# Altium schematic sheet ESPEV1.1.SchDoc
size A2
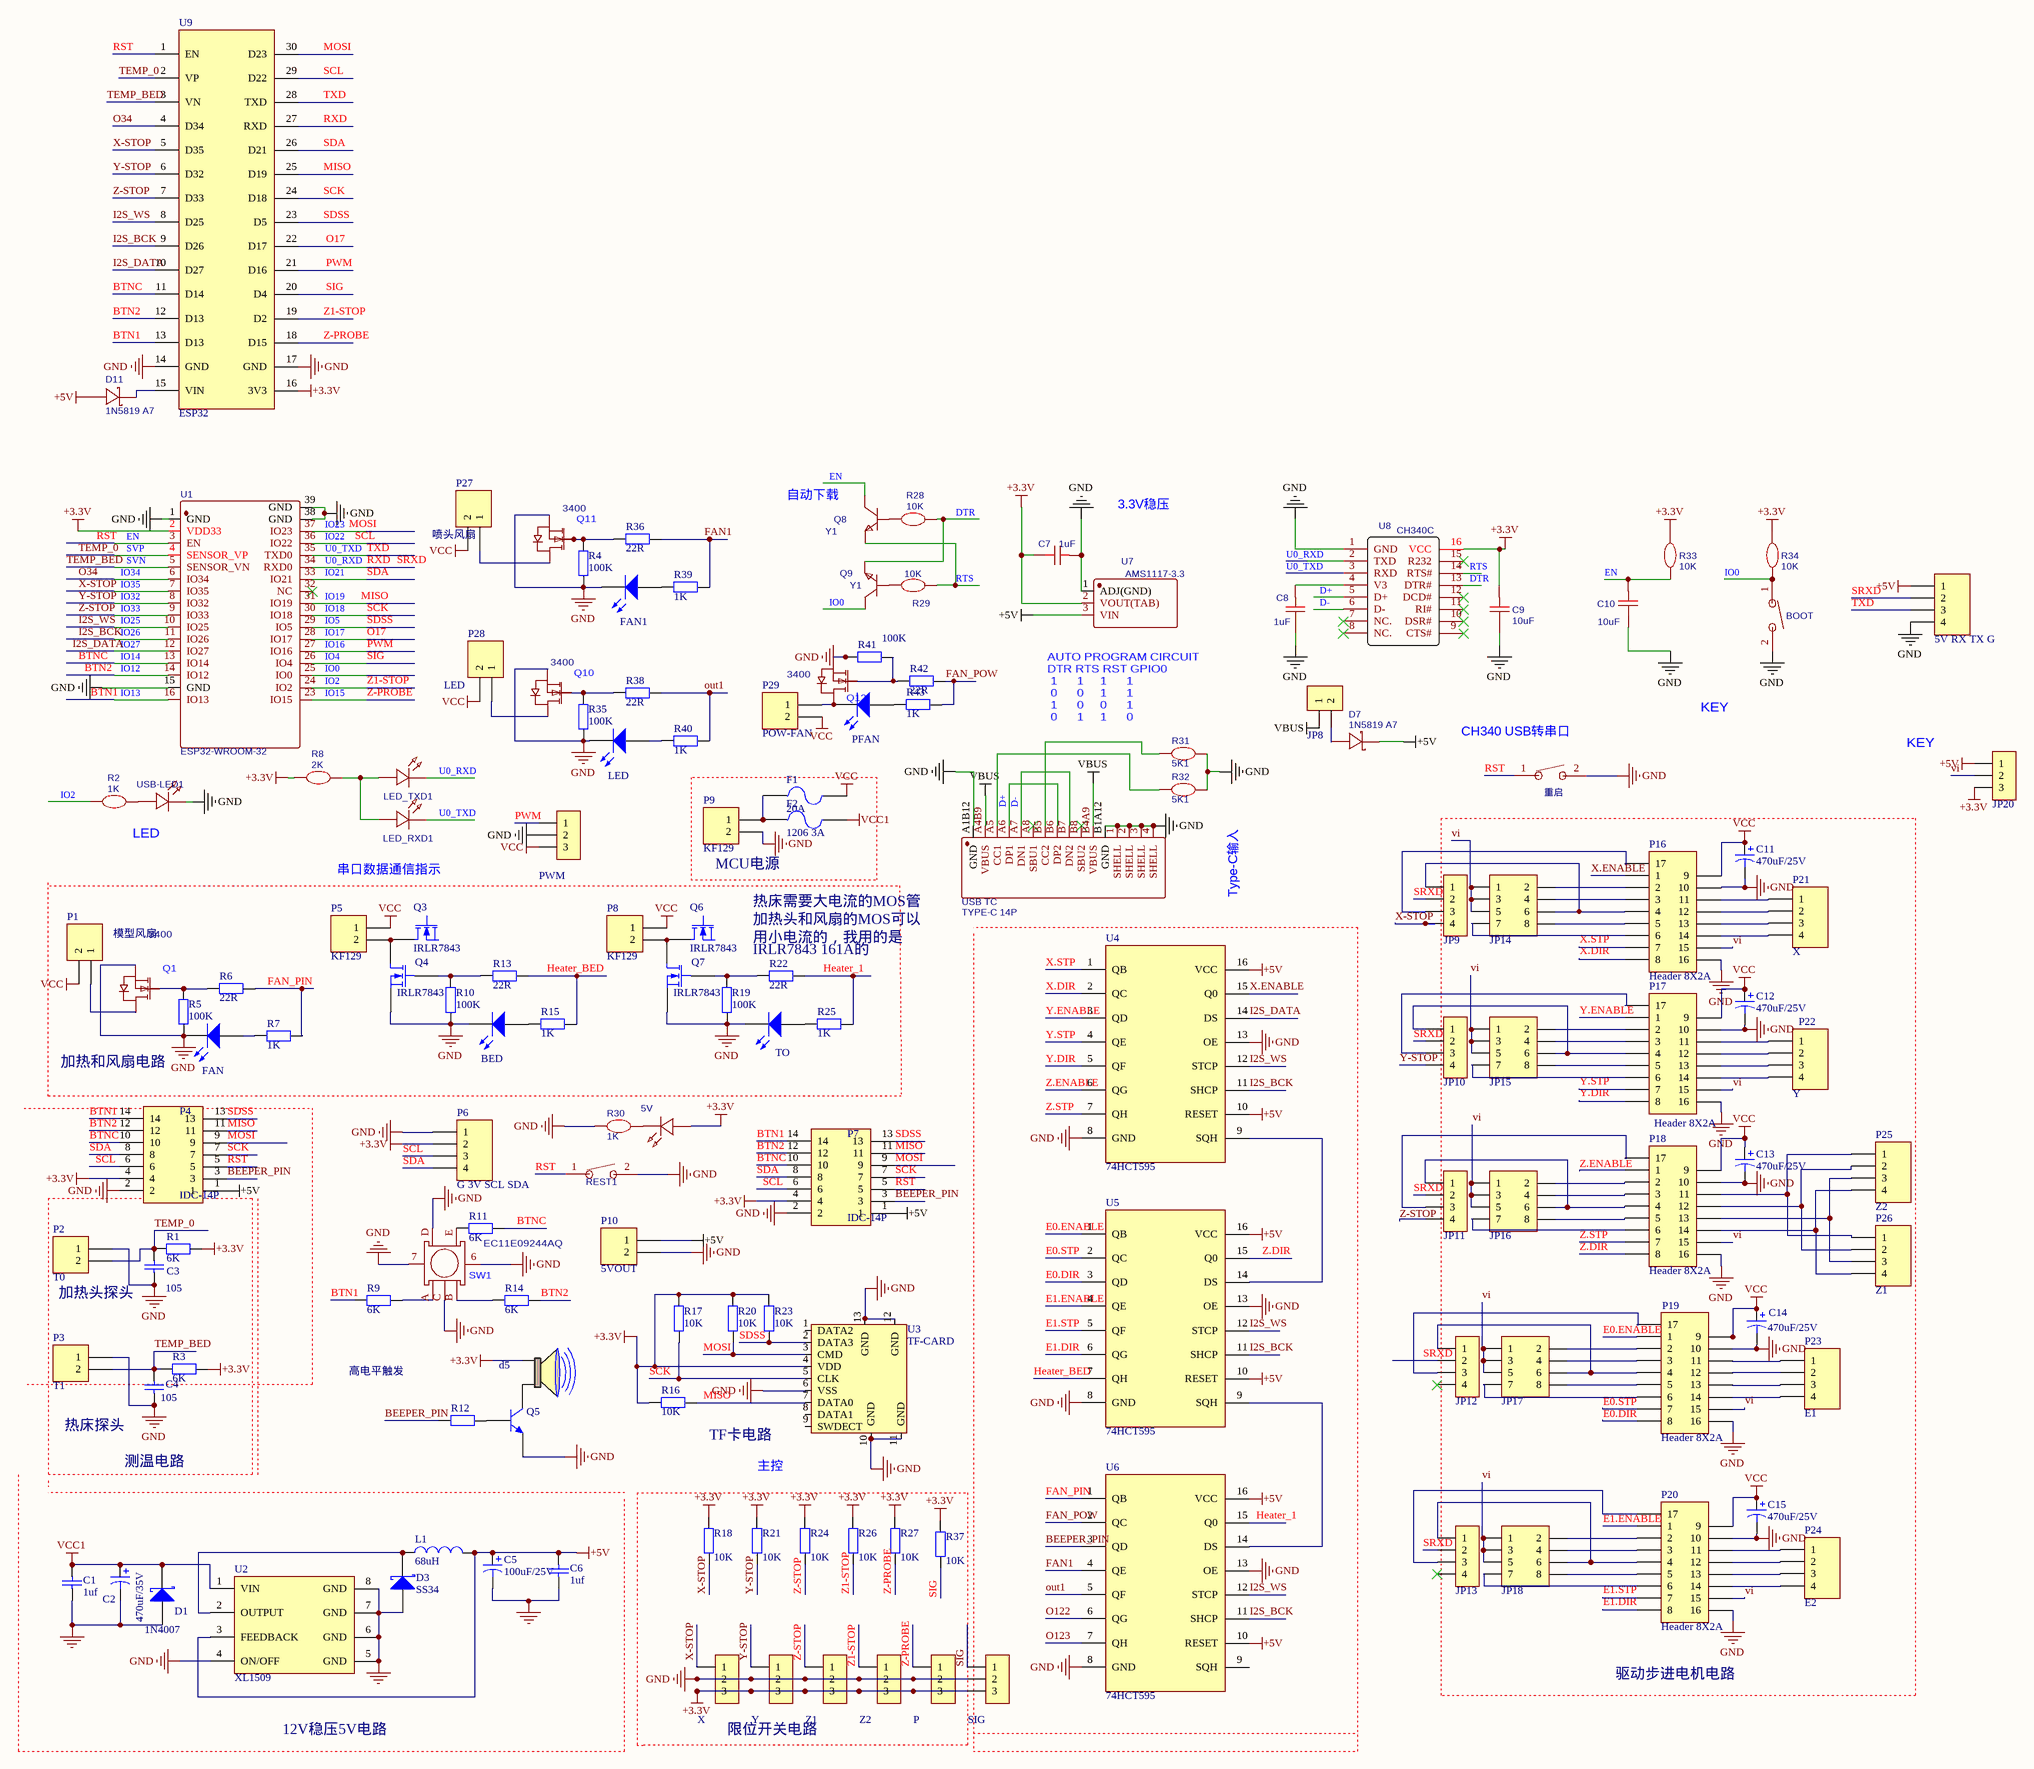
[diagram p0: ESPEV1.1.SchDoc]

## Parts
BOOT  BOOT  [SW-SMD_L4.0-W2.9-P4.15-EH]  (value not drawn)
C1  1uf  [C0603]
C2  470uF/35V  [SMD-EC10X10X10]
C3  value 105  [C0603]  (hidden comment: 1uf)
C4  value 105  [C0603]  (hidden comment: 1uf)
C5  100uF/25V  [SMD-EC6.3X6.3X10]
C6  1uf  [C0603]
C7  1uF  [C0603]
C8  1uF  [C0603]
C9  10uF  [C0603]
C10  10uF  [C0603]
C11  value 470uF/25V  [SMD-EC6.3X6.3X10]  (hidden comment: 100UF)
C12  value 470uF/25V  [SMD-EC6.3X6.3X10]  (hidden comment: 100UF)
C13  value 470uF/25V  [SMD-EC6.3X6.3X10]  (hidden comment: 100UF)
C14  value 470uF/25V  [SMD-EC6.3X6.3X10]  (hidden comment: 100UF)
C15  value 470uF/25V  [SMD-EC6.3X6.3X10]  (hidden comment: 100UF)
D1  1N4007  [SMA]
D2  FAN  [LED 0603B]
D3  SS34  [SMA]
D4  BED  [LED 0603B]
d5  buzzer  [BEEP 5x9x5.5]  (value not drawn)
D6  TO  [LED 0603B]
D7  1N5819 A7  [SOD-123_L2.8-W1.8-LS3.7-FD]
D8  FAN1  [LED 0603B]
D9  LED  [LED 0603B]
D10  PFAN  [LED 0603B]
D11  1N5819 A7  [SOD-123_L2.8-W1.8-LS3.7-FD]
F1  20A  [MCCQ-122]
F2  1206 3A  [FU 1206]
JP1  X  [XH2.54-LI-3P]
JP2  Y  [XH2.54-LI-3P]
JP3  SIG  [XH2.54-LI-3P]
JP4  Z1  [XH2.54-LI-3P]
JP5  Z2  [XH2.54-LI-3P]
JP6  P  [XH2.54-LI-3P]
JP7  PWM  [XH2.54-LI-3P]
JP8  U5V-ON  [HDR2.54-LI-2P]  (value not drawn)
JP9  URAT-无限位  [4P DL]  (value not drawn)
JP10  URAT-无限位  [4P DL]  (value not drawn)
JP11  URAT-无限位  [4P DL]  (value not drawn)
JP12  URAT-无限位  [4P DL]  (value not drawn)
JP13  URAT-无限位  [4P DL]  (value not drawn)
JP14  Header 4X2  [8P DL]  (value not drawn)
JP15  Header 4X2  [8P DL]  (value not drawn)
JP16  Header 4X2  [8P DL]  (value not drawn)
JP17  Header 4X2  [8P DL]  (value not drawn)
JP18  Header 4X2  [8P DL]  (value not drawn)
JP19  5V RX TX G  [HDR1X4]
JP20  3V-5V  [3P DL]  (value not drawn)
L1  68uH  [CDRH74]
LED1  5V  [LED 0603R]
LED_RXD1  RXD  [LED 0603G]  (value not drawn)
LED_TXD1  TXD  [LED 0603B]  (value not drawn)
P1  模型风扇  [XH2.54-LI-2P]
P2  T0  [XH2.54-LI-2P]
P3  T1  [XH2.54-LI-2P]
P4  IDC-14P  [IDC2.54-14P]
P5  KF129  [KF128-5.08-2P]
P6  G 3V SCL SDA  [OLED-0.96-PIN4]
P7  IDC-14P  [IDC2.54-14P]
P8  KF129  [KF128-5.08-2P]
P9  KF129  [KF128-5.08-2P]
P10  5VOUT  [XH2.54-LI-2P]
P16  Header 8X2A  [A4988]
P17  Header 8X2A  [A4988]
P18  Header 8X2A  [A4988]
P19  Header 8X2A  [A4988]
P20  Header 8X2A  [A4988]
P21  X  [XH2.54-LI-4P]
P22  Y  [XH2.54-LI-4P]
P23  E1  [XH2.54-LI-4P]
P24  E2  [XH2.54-LI-4P]
P25  Z2  [XH2.54-LI-4P]
P26  Z1  [XH2.54-LI-4P]
P27  喷头风扇  [XH2.54-LI-2P]
P28  LED  [XH2.54-LI-2P]
P29  POW-FAN  [XH2.54-LI-2P]
Q1  3400  [SOT-23-3]
Q3  IRLR7843  [TO-252gk]
Q4  IRLR7843  [TO-252]
Q5  Y1  [SOT-23-3]  (value not drawn)
Q6  IRLR7843  [TO-252gk]
Q7  IRLR7843  [TO-252]
Q8  Y1  [SOT-23-3]
Q9  Y1  [SOT-23-3]
Q10  3400  [SOT-23-3]
Q11  3400  [SOT-23-3]
Q12  3400  [SOT-23-3]
R1  6K  [R0603]
R2  1K  [R0603]
R3  6K  [R0603]
R4  100K  [R0603]
R5  100K  [R0603]
R6  22R  [R0603]
R7  1K  [R0603]
R8  2K  [R0603]
R9  6K  [R0603]
R10  100K  [R0603]
R11  6K  [R0603]
R12  4.7K  [R0603]  (value not drawn)
R13  22R  [R0603]
R14  6K  [R0603]
R15  1K  [R0603]
R16  10K  [R0603]
R17  10K  [R0603]
R18  10K  [R0603]
R19  100K  [R0603]
R20  10K  [R0603]
R21  10K  [R0603]
R22  22R  [R0603]
R23  10K  [R0603]
R24  10K  [R0603]
R25  1K  [R0603]
R26  10K  [R0603]
R27  10K  [R0603]
R28  10K  [R0603]
R29  10K  [R0603]
R30  1K  [R0603]
R31  5K1  [R0603]
R32  5K1  [R0603]
R33  10K  [R0603]
R34  10K  [R0603]
R35  100K  [R0603]
R36  22R  [R0603]
R37  10K  [R0603]
R38  22R  [R0603]
R39  1K  [R0603]
R40  1K  [R0603]
R41  100K  [R0603]
R42  22R  [R0603]
R43  1K  [R0603]
REST1  REST  [SMD-6X6X6]  (value not drawn)
REST2  重启  [SW-SMD_L4.0-W2.9-P4.15-EH]
SW1  EC11E09244AQ  [SW-TH_EC11E15244G1]
U1  ESP32-WROOM-32  [WIFIM-SMD_39P-L25.5-W18.0-P1.27]
U2  XL1509  [SOP8 - duplicate]
U3  TF-CARD  [MicroSD]
U4  74HCT595  [SOP16_1.27mm]
U5  74HCT595  [SOP16_1.27mm]
U6  74HCT595  [SOP16_1.27mm]
U7  AMS1117-3.3  [SOT-223-4_L6.5-W3.5-P2.30-LS7.0-BR]
U8  CH340C  [SOP-16_L10.0-W3.9-P1.27-LS6.0-BL]
U9  ESP32  [ESP3215P]
USB-LED1  UPWD  [LED 0603R]  (value not drawn)
USB_TC  TYPE-C 14P  [USB-C-SMD_TYPE-C16PIN]

## Blocks framed on the sheet
MCU电源: F1 F2 P9
驱动步进电机电路: C11-C15 JP9-JP18 P16-P26
限位开关电路: JP1 JP2 JP4-JP6 R18 R21 R24 R26 R27 R37

## Nets
+3.3V: C7.1 C9.2 d5.1 JP1.3 JP2.3 JP3.3 JP4.3 JP5.3 JP6.3 JP20.3 LED1.1 P4.4 P6.2 P7.4 R1.1 R3.2 R8.1 R16.1 R17.1 R18.2 R20.1 R21.2 R23.1 R24.2 R26.2 R27.2 R33.2 R34.2 R37.2 U1.2(VDD33) U3.4(VDD) U7.2(VOUT(TAB)) U8.16(VCC) U9.16(3V3)
+5V: C5.1 C6.2 D7.2(K) D11.1(A) JP19.1 JP20.1 L1.2 P4.1 P7.1 P10.1 U2.3(FEEDBACK) U4.10(RESET) U4.16(VCC) U5.10(RESET) U5.16(VCC) U6.10(RESET) U6.16(VCC) U7.3(VIN)
GND: BOOT.2 C1.2 C2.2 C3.2 C4.2 C5.2 C6.1 C7.2 C8.1 C9.1 C10.1 C11.2 C12.2 C13.2 C14.2 C15.2 D1.1(A) D2.2(K) D3.1(A) D4.2(K) D6.2(K) D8.2(K) D9.2(K) JP1.2 JP2.2 JP3.2 JP4.2 JP5.2 JP6.2 JP7.2 JP19.4 P2.1 P3.1 P4.2 P6.1 P7.2 P9.2 P10.2 P16.10 P16.16 P17.10 P17.16 P18.10 P18.16 P19.10 P19.16 P20.10 P20.16 Q1.2(S) Q4.3(S) Q5.2(E) Q7.3(S) Q10.2(S) Q11.2(S) Q12.2(S) R4.1 R5.1 R10.1 R19.1 R30.2 R31.1 R32.1 R35.1 R41.2 REST1.2 REST2.2 SW1.6 SW1.7 SW1.C SW1.D U1.1(GND) U1.15(GND) U1.38(GND) U1.39(GND) U2.4(ON/OFF) U2.5(GND) U2.6(GND) U2.7(GND) U2.8(GND) U3.6(VSS) U3.10(GND) U3.11(GND) U3.12(GND) U3.13(GND) U4.8(GND) U4.13(OE) U5.8(GND) U5.13(OE) U6.8(GND) U6.13(OE) U7.1(ADJ(GND)) U8.1(GND) U9.14(GND) U9.17(GND) USB-LED1.2 USB_TC.1(SHELL) USB_TC.2(SHELL) USB_TC.3(SHELL) USB_TC.4(SHELL) USB_TC.A1B12(GND) USB_TC.B1A12(GND)
VBUS: JP8.1 USB_TC.A4B9(VBUS) USB_TC.B4A9(VBUS)
VCC: C11.1 C12.1 C13.1 C14.1 C15.1 F1.2 JP7.3 P1.2 P5.1 P8.1 P16.9 P17.9 P18.9 P19.9 P20.9 P27.2 P28.2 P29.2
VCC1: C1.1 C2.1 D1.2(K) F2.2 U2.1(VIN)
BEEPER_PIN: P4.3 P7.3 R12.1 U6.3(QD)
BTN1: P4.14 P7.14 R9.1 U1.16(IO13) U9.13(D13)  [also labelled IO13]
BTN2: P4.12 P7.12 R14.2 U1.14(IO12) U9.12(D13)  [also labelled IO12]
BTNC: P4.10 P7.10 R11.1 U1.13(IO14) U9.11(D14)  [also labelled IO14]
D+: U8.5(D+) USB_TC.A6(DP1) USB_TC.B6(DP2)
D-: U8.6(D-) USB_TC.A7(DN1) USB_TC.B7(DN2)
DTR: Q9.2(E) R28.2 U8.13(DTR#)
E0.DIR: P19.8 U5.3(QD)
E0.ENABLE: P19.1 U5.1(QB)
E0.STP: P19.7 U5.2(QC)
E1.DIR: P20.8 U5.6(QG)
E1.ENABLE: P20.1 U5.4(QE)
E1.STP: P20.7 U5.5(QF)
EN: C10.2 P4.5 P7.5 Q8.3(C) R33.1 REST1.1 REST2.1 U1.3(EN) U9.1(EN)  [also labelled RST]
FAN1: R36.1 R39.1 U6.4(QE)
FAN_PIN: R6.1 R7.1 U6.1(QB)
FAN_POW: R42.1 R43.1 U6.2(QC)
Heater_1: R22.1 R25.1 U6.15(Q0)
Heater_BED: R13.1 R15.1 U5.7(QH)
I2S_BCK: U1.11(IO26) U4.11(SHCP) U5.11(SHCP) U6.11(SHCP) U9.9(D26)  [also labelled IO26]
I2S_DATA: U1.12(IO27) U4.14(DS) U9.10(D27)  [also labelled IO27]
I2S_WS: U1.10(IO25) U4.12(STCP) U5.12(STCP) U6.12(STCP) U9.8(D25)  [also labelled IO25]
IO0: BOOT.1 Q9.3(C) R34.1 U1.25(IO0)
IO2: JP5.1 R2.1 R26.1 U1.24(IO2) U9.19(D2)  [also labelled Z1-STOP]
IO4: JP3.1 R37.1 U1.26(IO4) U9.20(D4)  [also labelled SIG]
IO5: P4.13 P7.13 R23.2 U1.29(IO5) U3.2(DATA3) U9.23(D5)  [also labelled SDSS]
IO15: JP6.1 R27.1 U1.23(IO15) U9.18(D15)  [also labelled Z-PROBE]
IO16: JP7.1 U1.27(IO16) U9.21(D16)  [also labelled PWM]
IO17: U1.28(IO17) U9.22(D17)  [also labelled O17]
IO18: P4.7 P7.7 R17.2 U1.30(IO18) U3.5(CLK) U9.24(D18)  [also labelled SCK]
IO19: P4.11 P7.11 R16.2 U1.31(IO19) U3.7(DATA0) U9.25(D19)  [also labelled MISO]
IO21: P4.8 P6.4 P7.8 U1.33(IO21) U9.26(D21)  [also labelled SDA]
IO22: P4.6 P6.3 P7.6 U1.36(IO22) U9.29(D22)  [also labelled SCL]
IO23: P4.9 P7.9 R20.2 U1.37(IO23) U3.3(CMD) U9.30(D23)  [also labelled MOSI]
IO32: JP2.1 JP10.4 R21.1 U1.8(IO32) U9.6(D32)  [also labelled Y-STOP]
IO33: JP4.1 JP11.4 R24.1 U1.9(IO33) U9.7(D33)  [also labelled Z-STOP]
IO34: U1.6(IO34) U9.4(D34)  [also labelled O34]
IO35: JP1.1 JP9.4 R18.1 U1.7(IO35) U9.5(D35)  [also labelled X-STOP]
O122: U6.6(QG)
O123: U6.7(QH)
out1: R38.1 R40.1 U6.5(QF)
RTS: Q8.2(E) R29.2 U8.14(RTS#)
RXD: JP9.2 JP10.2 JP11.2 JP12.2 JP13.2 JP19.2 LED_TXD1.2 U1.34(RXD0) U8.2(TXD) U9.27(RXD)  [also labelled SRXD, U0_RXD]
SVN: C4.1 P3.2 R3.1 U1.5(SENSOR_VN) U9.3(VN)  [also labelled TEMP_BED]
SVP: C3.1 P2.2 R1.2 U1.4(SENSOR_VP) U9.2(VP)  [also labelled TEMP_0]
TXD: JP19.3 LED_RXD1.2 U1.35(TXD0) U8.3(RXD) U9.28(TXD)  [also labelled U0_TXD]
vi: JP14.1 JP14.3 JP14.5 JP15.1 JP15.3 JP15.5 JP16.1 JP16.3 JP16.5 JP17.1 JP17.3 JP17.5 JP18.1 JP18.3 JP18.5 JP20.2 P16.15 P17.15 P18.15 P19.15 P20.15
X.DIR: P16.8 U4.2(QC)
X.ENABLE: P16.1 U4.15(Q0)
X.STP: P16.7 U4.1(QB)
Y.DIR: P17.8 U4.5(QF)
Y.ENABLE: P17.1 U4.3(QD)
Y.STP: P17.7 U4.4(QE)
Z.DIR: P18.8 U5.15(Q0)
Z.ENABLE: P18.1 U4.6(QG)
Z.STP: P18.7 U4.7(QH)
NetC8_2: C8.2 U8.4(V3)
NetD2_1: D2.1(A) R7.2
NetD3_2: D3.2(K) L1.1 U2.2(OUTPUT)
NetD4_1: D4.1(A) R15.2
Netd5_2: d5.2 Q5.3(C)
NetD6_1: D6.1(A) R25.2
NetD7_1: D7.1(A) JP8.2
NetD8_1: D8.1(A) R39.2
NetD9_1: D9.1(A) R40.2
NetD10_1: D10.1(A) R43.2
NetD10_2: D10.2(K) P29.1 Q12.3(D)
NetD11_2: D11.2(K) U9.15(VIN)
NetF1_1: F1.1 F2.1 P9.1
NetJP9_1: JP9.1 JP14.6 P16.4
NetJP9_3: JP9.3 P16.17
NetJP10_1: JP10.1 JP15.6 P17.4
NetJP10_3: JP10.3 P17.17
NetJP11_1: JP11.1 JP16.6 P18.4
NetJP11_3: JP11.3 P18.17
NetJP12_1: JP12.1 JP17.6 P19.4
NetJP12_3: JP12.3 P19.17
NetJP13_1: JP13.1 JP18.6 P20.4
NetJP13_3: JP13.3 P20.17
NetJP14_2: JP14.2 P16.2
NetJP14_4: JP14.4 P16.3
NetJP14_7: JP14.7 P16.6
NetJP14_8: JP14.8 P16.5
NetJP15_2: JP15.2 P17.2
NetJP15_4: JP15.4 P17.3
NetJP15_7: JP15.7 P17.6
NetJP15_8: JP15.8 P17.5
NetJP16_2: JP16.2 P18.2
NetJP16_4: JP16.4 P18.3
NetJP16_7: JP16.7 P18.6
NetJP16_8: JP16.8 P18.5
NetJP17_2: JP17.2 P19.2
NetJP17_4: JP17.4 P19.3
NetJP17_7: JP17.7 P19.6
NetJP17_8: JP17.8 P19.5
NetJP18_2: JP18.2 P20.2
NetJP18_4: JP18.4 P20.3
NetJP18_7: JP18.7 P20.6
NetJP18_8: JP18.8 P20.5
NetLED1_2: LED1.2 R30.1
NetLED_RXD1_1: LED_RXD1.1 LED_TXD1.1 R8.2
NetP1_1: P1.1 Q1.3(D)
NetP5_2: P5.2 Q3.1(D) Q4.1(D)
NetP8_2: P8.2 Q6.1(D) Q7.1(D)
NetP16_11: P16.11 P21.1
NetP16_12: P16.12 P21.2
NetP16_13: P16.13 P21.3
NetP16_14: P16.14 P21.4
NetP17_11: P17.11 P22.1
NetP17_12: P17.12 P22.2
NetP17_13: P17.13 P22.3
NetP17_14: P17.14 P22.4
NetP18_11: P18.11 P25.1 P26.1
NetP18_12: P18.12 P25.2 P26.2
NetP18_13: P18.13 P25.3 P26.3
NetP18_14: P18.14 P25.4 P26.4
NetP19_11: P19.11 P23.1
NetP19_12: P19.12 P23.2
NetP19_13: P19.13 P23.3
NetP19_14: P19.14 P23.4
NetP20_11: P20.11 P24.1
NetP20_12: P20.12 P24.2
NetP20_13: P20.13 P24.3
NetP20_14: P20.14 P24.4
NetP27_1: P27.1 Q11.3(D)
NetP28_1: P28.1 Q10.3(D)
NetQ1_1: Q1.1(G) R5.2 R6.2
NetQ4_2: Q4.2(G) R10.2 R13.2
NetQ5_1: Q5.1(B) R12.2
NetQ7_2: Q7.2(G) R19.2 R22.2
NetQ8_1: Q8.1(B) R28.1
NetQ9_1: Q9.1(B) R29.1
NetQ10_1: Q10.1(G) R35.2 R38.2
NetQ11_1: Q11.1(G) R4.2 R36.2
NetQ12_1: Q12.1(G) R41.1 R42.2
NetR2_2: R2.2 USB-LED1.1
NetR9_2: R9.2 SW1.A
NetR11_2: R11.2 SW1.E
NetR14_1: R14.1 SW1.B
NetR31_2: R31.2 USB_TC.B5(CC2)
NetR32_2: R32.2 USB_TC.A5(CC1)
NetU4_9: U4.9(SQH) U5.14(DS)
NetU5_9: U5.9(SQH) U6.14(DS)

Not connected (* = marked no-connect by the designer): JP12 4*; JP13 4*; U1 32(NC)*; U3 1(DATA2) 8(DATA1) 9(SWDECT); U6 9(SQH); U8 7(NC.)* 8(NC.)* 9(CTS#)* 10(DSR#)* 11(RI#)* 12(DCD#)* 15(R232)*; USB_TC A8(SBU1)* B8(SBU2)*

## Notes on the sheet
- 自动下载
- 3.3V稳压
- AUTO PROGRAM CIRCUIT
  DTR RTS RST GPIO0
  1      1     1      1
  0      0     1      1
  1      0     0      1
  0      1     1      0
- KEY
- (near REST2) CH340 USB转串口
- LED
- 串口数据通信指示
- Type-C输入
- 热床需要大电流的MOS管
- 加热头和风扇的MOS可以
- (near R22) 用小电流的，我用的是
- (near R22) IRLR7843 161A的
- 加热和风扇电路
- (near P2) 加热头探头
- 高电平触发
- 热床探头
- (near R16) TF卡电路
- 测温电路
- 主控
- 12V稳压5V电路

## Library data of the parts
BOOT REST1 REST2 = TSA343G00D-250J2: BOM_Manufacturer: BRIGHT; Contributor: LCSC; BOM_Paste Type: expand; BOM_Assembly Type: smtWeld; BOM_Supplier: LCSC; BOM_Supplier Part: C354947; BOM_Manufacturer Part: TSA343G00D-250J2; spicePre: S; spiceSymbolName: TSA343G00D-250J2
C1 C6 = Cap: Capacitor; Value: 100pF; Published: 8-Jun-2000; LatestRevisionDate: 17-Jul-2002; LatestRevisionNote: Re-released for DXP Platform.; PackageReference: RAD-0.3; Publisher: Altium Limited; PackageDescription: Radial Cap, Thru-Hole; 2 Leads; 0.3 in Pin Spacing
C2 C5 = Cap Pol3: Polarized Capacitor (Surface Mount); Value: 100pF; Published: 8-Jun-2000; LatestRevisionDate: 29-May-2009; LatestRevisionNote: IPC-7351 Footprint Added.; PackageReference: C0805; Publisher: Altium Limited; PackageDescription: Chip Capacitor
C3 C4 = Cap: Capacitor; Published: 8-Jun-2000; LatestRevisionDate: 17-Jul-2002; LatestRevisionNote: Re-released for DXP Platform.; PackageReference: RAD-0.3; Publisher: Altium Limited
C7 C9 C10 = 10uF: nameAlias: Value(F); Contributor: LCEDA_Lib; spicePre: C; spiceSymbolName: C_0603_US
C8 = 1uF: BOM_Manufacturer Part: 0603F105M250NT; BOM_Manufacturer: FH; nameAlias: Value(F); Contributor: LCEDA_Lib; BOM_Supplier Part: C36577; BOM_Supplier: LCSC; spicePre: C; spiceSymbolName: C_0603_US
C11-C15 = Cap Pol1: Polarized Capacitor (Radial); Published: 8-Jun-2000; LatestRevisionDate: 17-Jul-2002; LatestRevisionNote: Re-released for DXP Platform.; PackageReference: RB7.6-15; Publisher: Altium Limited
D1 D3 = D Schottky: Schottky Diode; Published: 8-Jun-2000; LatestRevisionDate: 17-Jul-2002; LatestRevisionNote: Re-released for DXP Platform.; PackageReference: SMB; Publisher: Altium Limited; Code_JEDEC: DO-214-AA
D2 D4 D6 D8-D10 = LED2: Typical RED, GREEN, YELLOW, AMBER GaAs LED; Published: 8-Jun-2000; LatestRevisionDate: 17-Jul-2002; LatestRevisionNote: Re-released for DXP Platform.; PackageVersion: Feb-2002; PackageReference: 3.2X1.6X1.1; Publisher: Altium Limited
d5 = buzzer: bu
D7 D11 = 1N5819HW-7-F: BOM_Manufacturer: DIODES; BOM_Paste Type: expand; BOM_Assembly Type: smtWeld; BOM_Supplier: LCSC; BOM_Manufacturer Part: 1N5819HW-7-F; image: //image.lceda.cn/szlcsc/C82544.jpg; BOM_Supplier Part: C82544; spicePre: D; spiceSymbolName: 1N5819HW-7-F
F1 F2 = Fuse 2: Fuse; Published: 8-Jun-2000; LatestRevisionDate: 17-Jul-2002; LatestRevisionNote: Re-released for DXP Platform.; PackageReference: PIN-W2/E2.8; Publisher: Altium Limited; PackageDescription: Thru-Hole; 2 Leads
JP1-JP7 JP20 = Header 3: 3P接插件; 版权归属: 源创客; BOM名称: 3P接插件; 学习资源: www.ooocke.com
JP8 = Header 2: 2P接插件; 版权归属: 源创客; BOM名称: 2P接插件; 学习资源: www.ooocke.com
JP9-JP13 = Header 4: 4P接插件; 版权归属: 源创客; BOM名称: 4P接插件; 学习资源: www.ooocke.com
JP14-JP18 = Header 4X2: 4*2P接插件; 版权归属: 源创客; BOM名称: 4*2P接插件; 学习资源: www.ooocke.com
JP19 P6 P21-P26 = Header 4: Header, 4-Pin; LatestRevisionDate: 17-Jul-2002; LatestRevisionNote: Re-released for DXP Platform.; Publisher: Altium Limited
L1 = Inductor: Code_IEC: 1005; Value: 10mH; Published: 8-Jun-2000; LatestRevisionDate: 29-May-2009; LatestRevisionNote: IPC-7351 Footprint Added.; PackageReference: 0402-A; Publisher: Altium Limited; PackageDescription: Chip Inductor; Code_JEITA: 0402
LED1 = IO2: BOM_Manufacturer: EVERLIGHT(台湾亿光); BOM_Manufacturer Part: 19-217/R6C-AL1M2VY/3T; Contributor: LCEDA_01; BOM_Supplier Part: C72044; BOM_Supplier: LCSC; spicePre: L; spiceSymbolName: LED-0603_R
LED_RXD1 = RXD: BOM_Manufacturer: EVERLIGHT(台湾亿光); BOM_Manufacturer Part: 19-217/R6C-AL1M2VY/3T; Contributor: LCEDA_01; BOM_Supplier Part: C72044; BOM_Supplier: LCSC; spicePre: L; spiceSymbolName: LED-0603_R
LED_TXD1 = TXD: BOM_Manufacturer: EVERLIGHT(台湾亿光); BOM_Manufacturer Part: 19-217/R6C-AL1M2VY/3T; Contributor: LCEDA_01; BOM_Supplier Part: C72044; BOM_Supplier: LCSC; spicePre: L; spiceSymbolName: LED-0603_R
P1-P3 P5 P8-P10 P27-P29 = Header 2: Header, 2-Pin; LatestRevisionDate: 17-Jul-2002; LatestRevisionNote: Re-released for DXP Platform.; Publisher: Altium Limited
P16-P20 = Header 8X2A: Header, 8-Pin, Dual row; LatestRevisionDate: 17-Jul-2002; LatestRevisionNote: Re-released for DXP Platform.; Publisher: Altium Limited
Q1 Q10-Q12 = AO3400_C693097
Q3 Q6 = MOSFET-Ngk: N-Channel MOSFET; Published: 8-Jun-2000; LatestRevisionDate: 17-Jul-2002; LatestRevisionNote: Re-released for DXP Platform.; PackageVersion: 1995/1996; PackageReference: E3; Publisher: Altium Limited
Q4 Q7 = MOSFET-N: N-Channel MOSFET; Published: 8-Jun-2000; LatestRevisionDate: 17-Jul-2002; LatestRevisionNote: Re-released for DXP Platform.; PackageVersion: 1995/1996; PackageReference: E3; Publisher: Altium Limited
Q5 = SOT-23 SS8050 Y1: SS8050 Y1三极管; ComponentLink1Description: 供应商链接; ComponentLink1URL: http://www.szlcsc.com/product/details_2507.html; Package: SOT-23; Supplier: LC; SuppliersPartNumber: C2150
Q8 Q9 = S8050: BOM_Manufacturer: WPMtek(维攀微); Contributor: LCSC; BOM_Supplier: LCSC; BOM_Supplier Part: C2688231; BOM_Manufacturer Part: S8050; spicePre: Q; spiceSymbolName: S8050
R1 R3-R7 R9-R11 R13-R27 R35-R43 = Res2: Resistor; Published: 8-Jun-2000; LatestRevisionDate: 17-Jul-2002; LatestRevisionNote: Re-released for DXP Platform.; PackageReference: AXIAL-0.4; Publisher: Altium Limited
  R1 R3 R9 R11 R14: Value: 6K
  R4 R5 R10 R19 R35 R41: Value: 100K
  R6 R13 R22 R36 R38 R42: Value: 22R
  R7 R15 R25 R39 R40 R43: Value: 1K
  R16-R18 R20 R21 R23 R24 R26 R27 R37: Value: 10K
R2 R30 = 1K: nameAlias: Value(Ω); Contributor: LCEDA_Lib; spicePre: R; spiceSymbolName: R_0603_EU
R8 = 2K: nameAlias: Value(Ω); Contributor: LCEDA_Lib; spicePre: R; spiceSymbolName: R_0603_EU
R12 = 0805 4.7KΩ (4701) 1%: 4.7KΩ (4701) ±1%贴片电阻; ComponentLink1Description: 供应商链接; ComponentLink1URL: http://www.szlcsc.com/product/details_18361.html; Package: 0805; Supplier: LC; SuppliersPartNumber: C17673
R28 R29 R33 R34 = 10K: nameAlias: Value(Ω); Contributor: LCEDA_Lib; spicePre: R; spiceSymbolName: R_0603_EU
R31 R32 = 5K1: nameAlias: Value(Ω); Contributor: LCEDA_Lib; spicePre: R; spiceSymbolName: R_0603_EU
U1 = ESP32-WROOM-32: BOM_Manufacturer: Espressif Systems; Contributor: LCSC; BOM_Supplier: LCSC; BOM_Supplier Part: C503587; BOM_Manufacturer Part: ESP32-WROOM-32; spicePre: U; spiceSymbolName: ESP32-WROOM-32
U2 = Component_1
U3 = TF2
U7 = AMS1117-3.3_C347256: BOM_Manufacturer: Youtai Semiconductor Co., Ltd.; Contributor: LCSC; BOM_Paste Type: expand; BOM_Assembly Type: smtWeld; BOM_Supplier: LCSC; BOM_Supplier Part: C347256; BOM_Manufacturer Part: AMS1117-3.3; spicePre: U; spiceSymbolName: AMS1117-3.3_C347256
U8 = CH340C: BOM_Manufacturer: WCH; BOM_Paste Type: recommend; BOM_Supplier: LCSC; BOM_Manufacturer Part: CH340C; BOM_Supplier Part: C84681; spicePre: U; spiceSymbolName: CH340C
U9 = ESP32-WROOm
USB-LED1 = LED-0603_R: BOM_Manufacturer: EVERLIGHT(台湾亿光); BOM_Manufacturer Part: 19-217/R6C-AL1M2VY/3T; Contributor: LCEDA_01; BOM_Supplier Part: C72044; BOM_Supplier: LCSC; spicePre: L; spiceSymbolName: LED-0603_R
USB_TC = TYPE-C16PIN: BOM_Manufacturer: SHOU HAN; Contributor: LCSC; BOM_Supplier: LCSC; BOM_Supplier Part: C393939; BOM_Manufacturer Part: TYPE-C16PIN; spicePre: U; spiceSymbolName: TYPE-C16PIN